# Altium schematic sheet Current_Sense.SchDoc
size A4
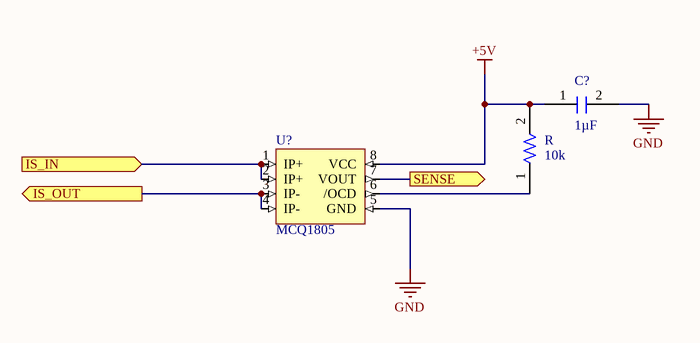
[diagram p0: Current_Sense.SchDoc]

## Parts
C?  value 1µF  [C1206FNPC-RW]  (hidden comment: C1u-16V-1206FNPC-X7R)
R  value 10k  [0805]  (hidden comment: R10k_0805_0.25W)
U?  MCQ1805  [SOIC127P600X175-8N]

## Ports
IS_IN (in), IS_OUT (out), SENSE (out)

## Nets
+5V: C?.1 R.2 U?.8(VCC)
GND: C?.2 U?.5(GND)
IS_IN: U?.1(IP+) U?.2(IP+) ; port IS_IN
IS_OUT: U?.3(IP-) U?.4(IP-) ; port IS_OUT
SENSE: U?.7(VOUT) ; port SENSE
NetR_1: R.1 U?.6(/OCD)

## Library data of the parts
C? = CMP-00051-1: Cap Cer 1UF 16V X7R 1206; Manufacturer Part Number: 885012208036; Manufacturer: Wurth Electronics; .Creator: GP; Tolerance: 10%; Min Operating Temperature: -55°C; ComponentLink1Description: Datasheet; Thickness: 0.051inch; Source: Passives.SchLib; RoHS Compliant: Yes; Pricing 1: 1=0,15000, 10=0,13900, 50=0,13900, 100=0,12400, 500=0,11000, 1000=0,11000, 3000=0,09100, 10000=0,09100 (USD); Stock 1: 5938; Width: 0.063inch; RoHS: Yes; Category: Capacitor; ComponentLink2URL: https://www.we-online.com/catalog/en/WCAP-CSGP-16VDC#885012208036; Voltage Rating: 16V; Max Operating Temperature: 125°C; Case Code (Metric): 3216; Case/Package: 1206; Packaging: Tape and Reel; Length: 0.126inch; Design Item ID: C1u-16V-1206FNPC-X7R; ComponentLink1URL: https://www.we-online.com/catalog/datasheet/885012208036.pdf; Mount: Surface Mount; ComponentLink2Description: Where buy it
R = CMP-009-00035-3: Resistor, 10K, 0.25W, Thick Film, 0805 Rohs Compliant: Yes
U? = CMP-010-00000-4: 3kVRMS Isolated Hall-Effect Current Sensor.; ComponentLink1URL: https://www.monolithicpower.com/en/documentview/productdocument/index/version/2/document_type/Datasheet/lang/en/sku/MCS1806GS/document_id/10148/; ComponentLink1Description: Datasheet